# Altium project ECE453-Custom.PrjPcb
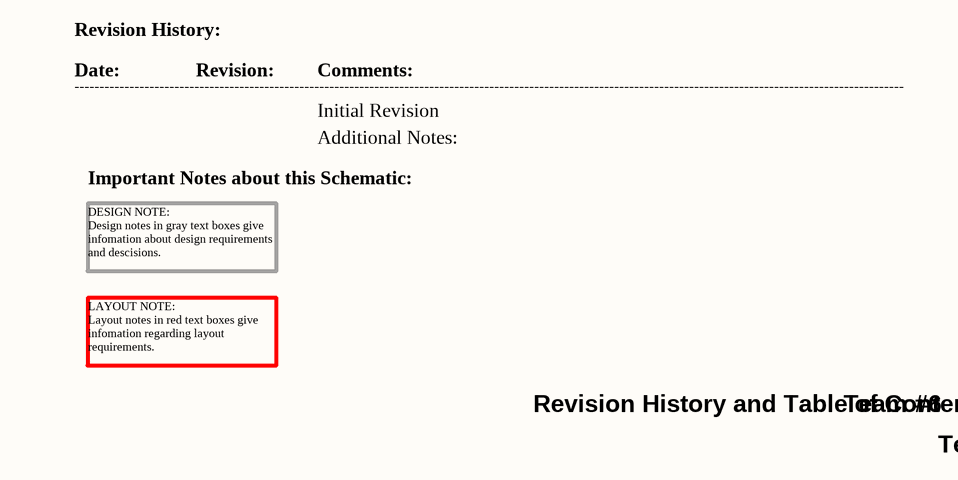
[diagram p0: 01-Revision_History_and_Contents.SchDoc]
3 sheets, 13 parts. Net scope: global (net labels, ports and power ports of the same name join across sheets).
Board file: ECE453_Custom.PcbDoc
Sheets:
  01-Revision_History_and_Contents.SchDoc
  02-Mezzanine.SchDoc
  03_Mechanicals.SchDoc

## Sheet 01-Revision_History_and_Contents.SchDoc: Revision History and Contents
size A; Date: 4/25/2017; ApprovedBy: JSK; CheckedBy: JSK; Author: JSK; CompanyName: University of Wisconsin; DrawnBy: JSK; Engineer: JSK; Organization: ECE 315; Address1: College of Engineering; Address2: 1415 Engineering Drive; Address3: Madison, WI 53706; Address4: ECE 453 Spring 2017; Revision: A; SheetNumber: 1; SheetTotal: 2

### Notes on the sheet
- Revision History:
- Date:
- ----------------------------------------------------------------------------------------------------------------------------------------------------------------------
- Revision:
- Comments:
- Initial Revision
- Important Notes about this Schematic:
- Additional Notes:
- DESIGN NOTE:
  Design notes in gray text boxes give infomation about design requirements and descisions.
- LAYOUT NOTE:
  Layout notes in red text boxes give infomation regarding layout requirements.
- Revision History and Table of Contents
- Team #6
- Team Members <Modify>

## Sheet 02-Mezzanine.SchDoc: ECE453 Power
size A; Date: 4/25/2017; ApprovedBy: JSK; CheckedBy: JSK; Author: JSK; CompanyName: University of Wisconsin; DrawnBy: JSK; Engineer: JSK; Organization: ECE 315; Address1: College of Engineering; Address2: 1415 Engineering Drive; Address3: Madison, WI 53706; Address4: ECE 453 Fall 2022; Revision: A; SheetNumber: 2; SheetTotal: 2; AssemblyNumber: ECE453-F22-01
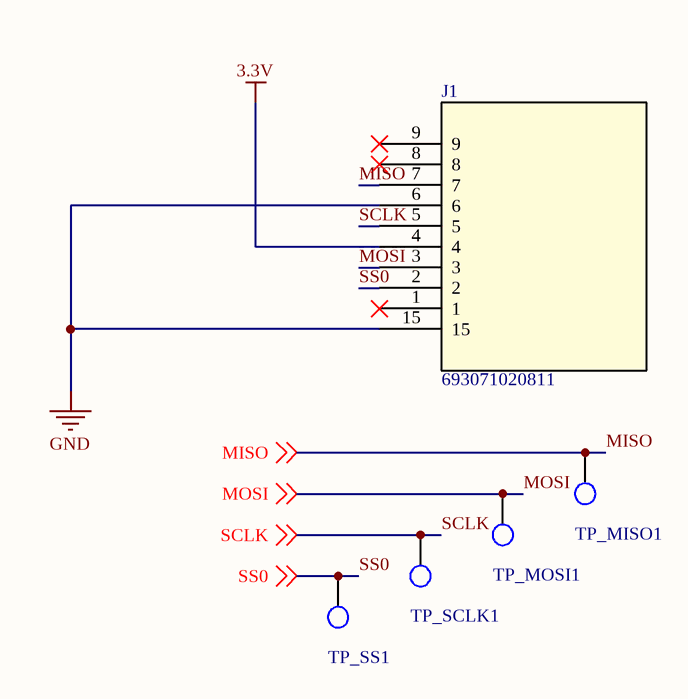
[diagram p1: 02-Mezzanine.SchDoc]

### Parts
J1  693071020811  [CONN9_020811_WRE]
TP_MISO1  TP_1206  [TP-SMC-1206]  (value not drawn)
TP_MOSI1  TP_1206  [TP-SMC-1206]  (value not drawn)
TP_SCLK1  TP_1206  [TP-SMC-1206]  (value not drawn)
TP_SS1  TP_1206  [TP-SMC-1206]  (value not drawn)

### Nets
3.3V: J1.4
GND: J1.6 J1.15
MISO: J1.7 TP_MISO1.1 ; off-sheet MISO
MOSI: J1.3 TP_MOSI1.1 ; off-sheet MOSI
SCLK: J1.5 TP_SCLK1.1 ; off-sheet SCLK
SS0: J1.2 TP_SS1.1 ; off-sheet SS0

Not connected (* = marked no-connect by the designer): J1 1* 8* 9*

### Library data of the parts
J1 = 693071020811: No Description Available; Mfr_Name: Wurth Electronics; Copyright: Copyright (C) 2022 Ultra Librarian. All rights reserved.; Manufacturer_Part_Number: 693071020811; Digi-Key_Part_Number_1: 732-693071020811TR-ND; Digi-Key_Part_Number_2: 732-693071020811CT-ND; Digi-Key_Part_Number_3: 732-693071020811DKR-ND; RefDes: RefDes; Type: DEV
TP_MISO1 TP_MOSI1 TP_SCLK1 TP_SS1 = TP_1206: Test Point SMD 1206; Manufacturer: TE Connectivity (Tyco Electronics); Manufacturer Part Number: 1625854-1; Resistance Value: 0 Ohm; Temperature Coefficient: N/R; Supplier: Digi-Key; Stock 1: 31937; Pricing 1: 1=0.28, 10=0.261, 25=0.224, 50=0.1902, 100=0.1828, 250=0.1641, 500=0.1567, 1000=0.1306 (USD); Case Size: 1206; Dimension: 3.2 x 1.6 x 1.25mm; Family: RC; Mounting: Surface Mount; Operating Temperature: -55 to 125 C; Part No: 1625854-1; RoHS: Yes; Packaging: Tape and Reel; Termination Style: N/R; Terminal Pitch: N/R; Power Rating: N/R; Tolerance: N/R; ComponentLink1URL: https://datasheet.ciiva.com/6439/eng-ds-1773266-a-6439169.pdf; ComponentLink1Description: https://datasheet.ciiva.com/6439/eng-ds-1773266-a-6439169.pdf; ComponentLink2URL: https://datasheet.ciiva.com/30136/1773266-a-30136341.pdf; ComponentLink2Description: https://datasheet.ciiva.com/30136/1773266-a-30136341.pdf; ComponentLink3URL: https://datasheet.ciiva.com/6439/eng-ds-1773266-a-6439080.pdf; ComponentLink3Description: https://datasheet.ciiva.com/6439/eng-ds-1773266-a-6439080.pdf; ComponentLink4URL: https://datasheet.ciiva.com/6439/eng-ds-1773266-a-6439081.pdf; ComponentLink4Description: https://datasheet.ciiva.com/6439/eng-ds-1773266-a-6439081.pdf; ComponentLink5URL: https://datasheet.ciiva.com/6439/eng-ds-1773266-a-6439083.pdf; ComponentLink5Description: https://datasheet.ciiva.com/6439/eng-ds-1773266-a-6439083.pdf; Supplier Part Number: A106143CT-ND

## Sheet 03_Mechanicals.SchDoc
size A; ApprovedDate: 04/02/2019; AssemblyNumber: ECE315-F19
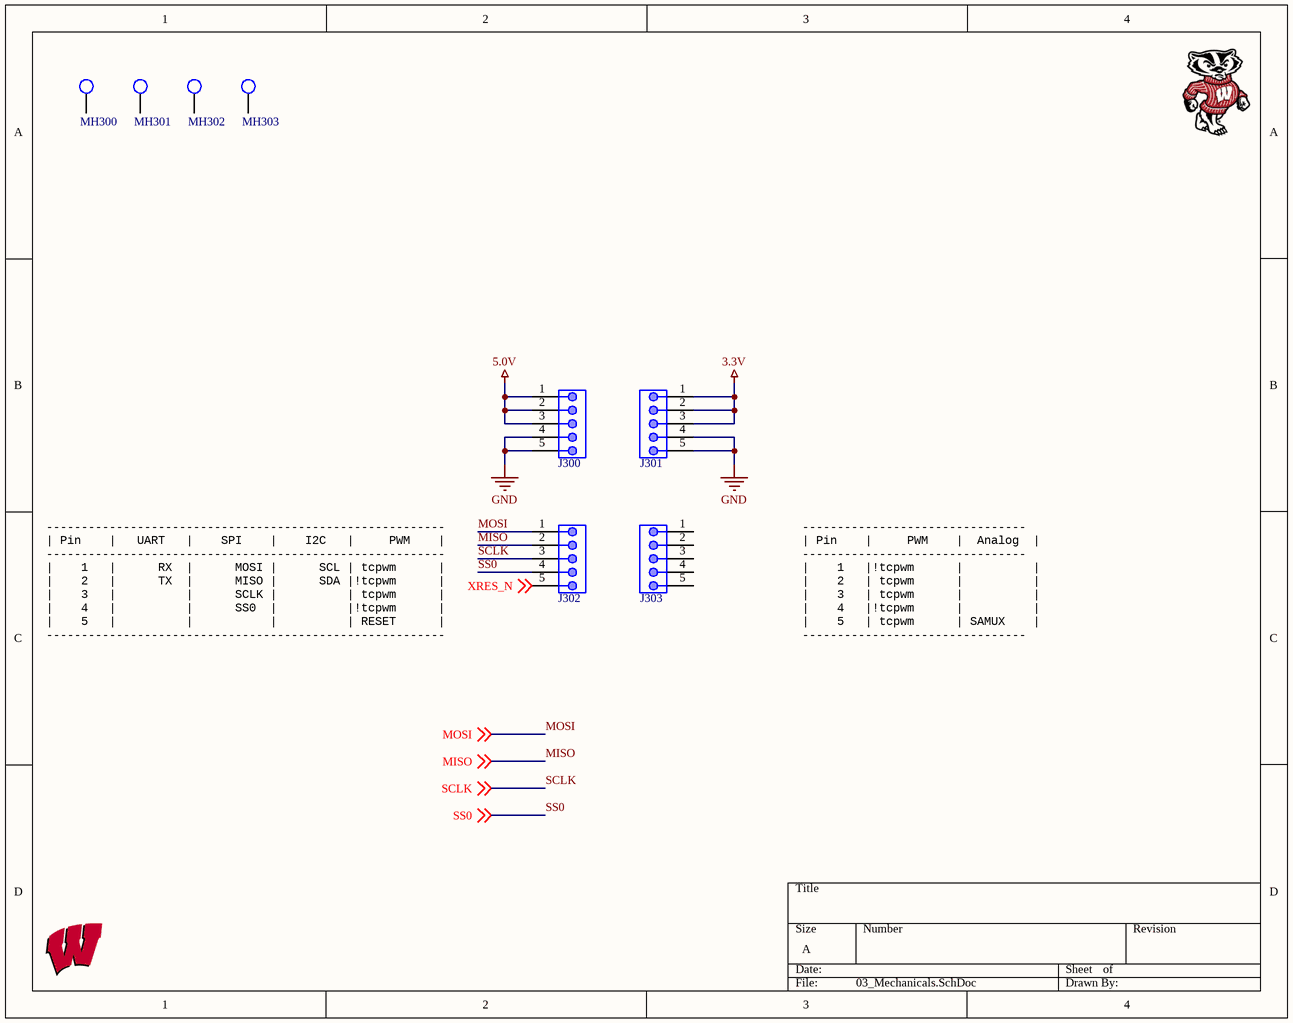
[diagram p2: 03_Mechanicals.SchDoc]

### Parts
J300  CONN_HEADER_MALE_1x5  [HDR1X5]  (value not drawn)
J301  CONN_HEADER_MALE_1x5  [HDR1X5]  (value not drawn)
J302  CONN_HEADER_MALE_1x5  [HDR1X5]  (value not drawn)
J303  CONN_HEADER_MALE_1x5  [HDR1X5]  (value not drawn)
MH300  MHOLE_2_55MM  [MHOLE_2_55MM]  (value not drawn)  (no BOM)
MH301  MHOLE_2_55MM  [MHOLE_2_55MM]  (value not drawn)  (no BOM)
MH302  MHOLE_2_55MM  [MHOLE_2_55MM]  (value not drawn)  (no BOM)
MH303  MHOLE_2_55MM  [MHOLE_2_55MM]  (value not drawn)  (no BOM)

### Nets
3.3V: J301.1 J301.2 J301.3
5.0V: J300.1 J300.2 J300.3
GND: J300.4 J300.5 J301.4 J301.5
MISO: J302.2 ; off-sheet MISO
MOSI: J302.1 ; off-sheet MOSI
SCLK: J302.3 ; off-sheet SCLK
SS0: J302.4 ; off-sheet SS0
XRES_N: J302.5 ; off-sheet XRES_N

Not connected (* = marked no-connect by the designer): J303 1 2 3 4 5; MH300 1; MH301 1; MH302 1; MH303 1

### Notes on the sheet
- ---------------------------------------------------------
  | Pin    |   UART   |    SPI    |    I2C   |     PWM    |
  ---------------------------------------------------------
  |    1   |      RX  |      MOSI |      SCL | tcpwm      |
  |    2   |      TX  |      MISO |      SDA |!tcpwm      |
  |    3   |          |      SCLK |          | tcpwm      |
  |    4   |          |      SS0  |          |!tcpwm      |
  |    5   |          |           |          | RESET      |
  ---------------------------------------------------------
- --------------------------------
  | Pin    |     PWM    |  Analog  |
  --------------------------------
  |    1   |!tcpwm      |          |
  |    2   | tcpwm      |          |
  |    3   | tcpwm      |          |
  |    4   |!tcpwm      |          |
  |    5   | tcpwm      | SAMUX    |
  --------------------------------

### Library data of the parts
J300-J303 = CONN_HEADER_MALE_1x5: Header, 5-Pin; Manufacturer 1: Sullins; Manufacturer Part Number 1: PREC005SACN-RC; Number of Positions: 5; Connector Type: Male Pin; Pitch: 0.1inch; ComponentLink1URL: http://www.farnell.com/cad/1737268.pdf; ComponentLink1Description: http://www.farnell.com/cad/1737268.pdf; ComponentLink2URL: http://katalog.we-online.de/em/datasheet/6130xx11121.pdf; ComponentLink2Description: http://katalog.we-online.de/em/datasheet/6130xx11121.pdf; Supplier 1: Digi-Key; Stock 1: 0; Pricing 1: 1=0.19000, 10=0.17400, 25=0.12960, 50=0.11120, 100=0.10740, 250=0.09264, 500=0.08892 (USD); RoHS: Yes; Mount: Through Hole; Color: Black; Contact Plating: Tin; Package Quantity: 1; Number of Rows: 1; Packaging: Bulk; Termination: Solder; Contact Mating Length: 0.23inch; ComponentLink3URL: https://datasheet.ciiva.com/741/xrxczzzsxxn-rc-st-11635-b-741840.pdf?src-supplier=Digi-Key; ComponentLink3Description: https://datasheet.ciiva.com/741/xrxczzzsxxn-rc-st-11635-b-741840.pdf?src-supplier=Digi-Key; Supplier Part Number 1: S1032EC-05-ND
MH300-MH303 = MHOLE_2_55MM: Mounting Holde; Manufacturer Part Number: UW MTHOLE

## Nets that join several sheets
3.3V: 02-Mezzanine (J1.4), 03_Mechanicals (J301.1 J301.2 J301.3)
GND: 02-Mezzanine (J1.6 J1.15), 03_Mechanicals (J300.4 J300.5 J301.4 J301.5)
MISO: 02-Mezzanine (J1.7 TP_MISO1.1), 03_Mechanicals (J302.2)
MOSI: 02-Mezzanine (J1.3 TP_MOSI1.1), 03_Mechanicals (J302.1)
SCLK: 02-Mezzanine (J1.5 TP_SCLK1.1), 03_Mechanicals (J302.3)
SS0: 02-Mezzanine (J1.2 TP_SS1.1), 03_Mechanicals (J302.4)